# EAGLE design arduino nano (EAGLE 9.6.2)
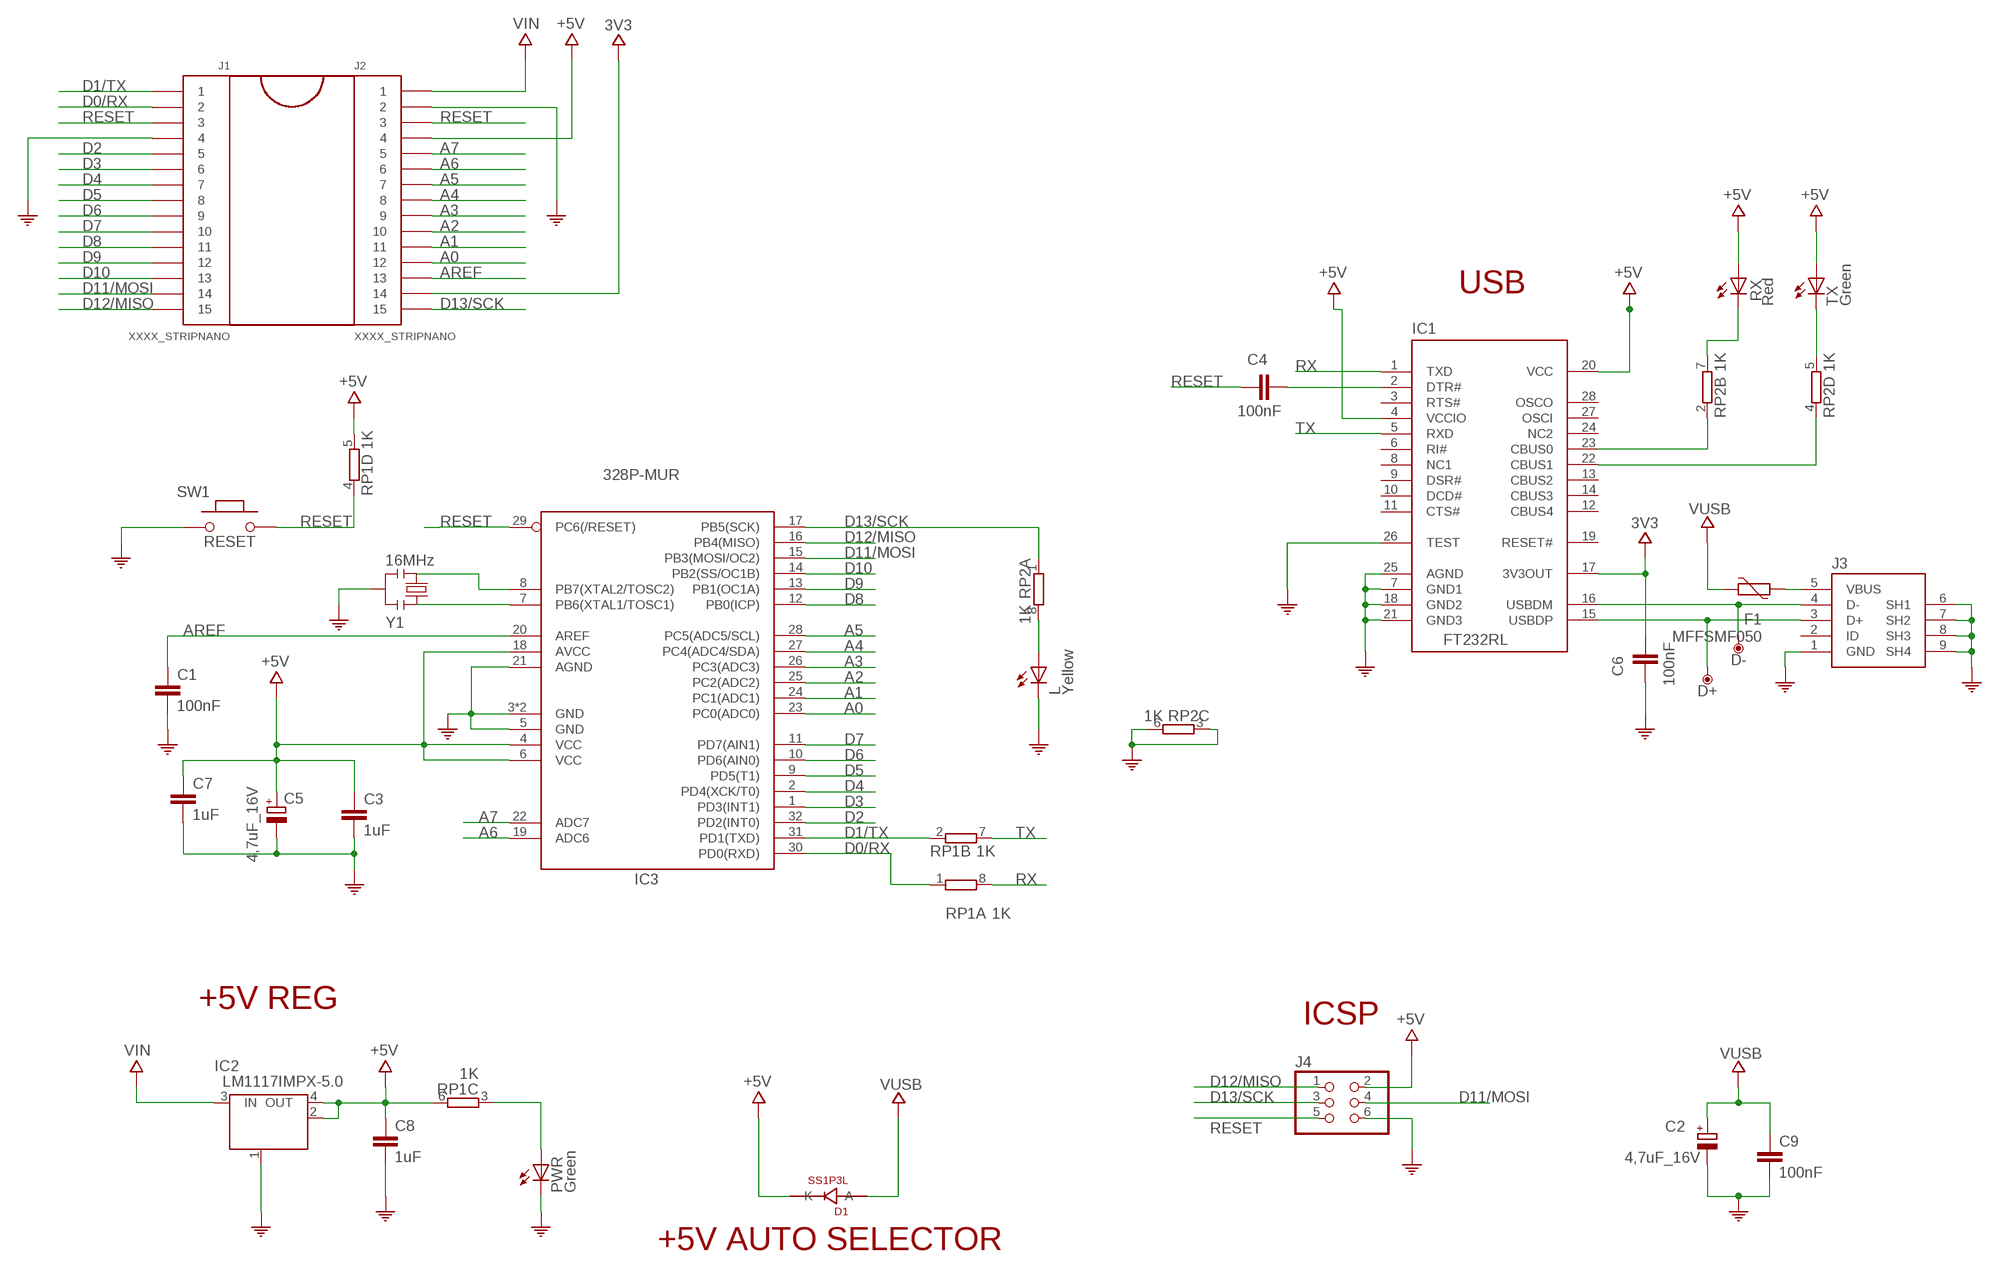
[diagram p0: schematic, sheet 1]

## Parts
C1  100nF  0015_100NF_0603  [C0603-ROUND]
C2  4,7uF_16V  0833_TAJA475MO16RNJ  [TAN-A]
C3  1uF  0006_1UF_0603/GRM188R61E105KA12D  [C0603-ROUND]
C4  100nF  0015_100NF_0603  [C0603-ROUND]
C5  4,7uF_16V  0833_TAJA475MO16RNJ  [TAN-A]
C6  100nF  0015_100NF_0603  [C0603-ROUND]
C7  1uF  0006_1UF_0603/GRM188R61E105KA12D  [C0603-ROUND]
C8  1uF  0006_1UF_0603/GRM188R61E105KA12D  [C0603-ROUND]
C9  100nF  0015_100NF_0603  [C0603-ROUND]
D1  SS1P3L  0025_SS1P3L-M3/84A  [DO220AAL]
D+  DNP  TPTP-1.00MM  [TP-1.00MM]
D-  DNP  TPTP-1.00MM  [TP-1.00MM]
F1  MFFSMF050  PTC  [0603-1608X90N]
IC1  FT232RL  0226_FT232RL  [SSOP28]
IC2  LM1117IMPX-5.0  0022_LM1117IMPX-5.0  [LINEAR_SOT223]
IC3  328P-MUR  ATMEGA328P-32MUR  [VQFN32]
J1  XXXX_STRIPNANO  [HEAD15-NOSS]
J2  XXXX_STRIPNANO  [HEAD15-NOSS]
J3  0219_14850  [USB-MINI-B_2]
J4  0114_PH254-203DF118A00V  [2X03]
L  Yellow  0044_KPT-2012YC  [CHIPLED_0805]
PWR  Green  0043_KPT-2012SGC  [CHIPLED_0805]
RP1  1K  0005_064R_1K_/_CAY16-102J4LF  [CAY16]
RP2  1K  0005_064R_1K_/_CAY16-102J4LF  [CAY16]
RX  Red  0181_KTP-2012SURCK  [CHIPLED_0805]
SW1  RESET  0173_IT-1185AP1C-160G-G_T&R  [SMD_157SW]
TX  Green  0043_KPT-2012SGC  [CHIPLED_0805]
Y1  16MHz  0011_CSTCE16M0V53-R0  [RESONATOR]

## Nets
3V3: C6.2 IC1.17(3V3OUT) J2.14
+5V: C3.1 C5.1(+) C7.1 C8.1 D1.P$1(K) IC1.4(VCCIO) IC1.20(VCC) IC2.2(OUT) IC2.4(OUT) IC3.4(VCC) IC3.6(VCC) IC3.18(AVCC) J2.4 J4.2 RP1.5 RP1.6 RX.A TX.A
A0: IC3.23(PC0(ADC0)) J2.12
A1: IC3.24(PC1(ADC1)) J2.11
A2: IC3.25(PC2(ADC2)) J2.10
A3: IC3.26(PC3(ADC3)) J2.9
A4: IC3.27(PC4(ADC4/SDA)) J2.8
A5: IC3.28(PC5(ADC5/SCL)) J2.7
A6: IC3.19(ADC6) J2.6
A7: IC3.22(ADC7) J2.5
AREF: C1.1 IC3.20(AREF) J2.13
COM: C1.2 C2.2(-) C3.2 C5.2(-) C6.1 C7.2 C8.2 C9.2 IC1.7(GND1) IC1.18(GND2) IC1.21(GND3) IC1.25(AGND) IC1.26(TEST) IC2.1(GND/ADJ) IC3.3(GND) IC3.5(GND) IC3.21(AGND) IC3.33(GND) J1.4 J2.2 J3.1(GND) J3.6(SH1) J3.7(SH2) J3.8(SH3) J3.9(SH4) J4.6 L.C PWR.C RP2.3 RP2.6 SW1.1 Y1.2
D0/RX: IC3.30(PD0(RXD)) J1.2 RP1.1
D1/TX: IC3.31(PD1(TXD)) J1.1 RP1.2
D2: IC3.32(PD2(INT0)) J1.5
D3: IC3.1(PD3(INT1)) J1.6
D4: IC3.2(PD4(XCK/T0)) J1.7
D5: IC3.9(PD5(T1)) J1.8
D6: IC3.10(PD6(AIN0)) J1.9
D7: IC3.11(PD7(AIN1)) J1.10
D8: IC3.12(PB0(ICP)) J1.11
D9: IC3.13(PB1(OC1A)) J1.12
D10: IC3.14(PB2(SS/OC1B)) J1.13
D11/MOSI: IC3.15(PB3(MOSI/OC2)) J1.14 J4.4
D12/MISO: IC3.16(PB4(MISO)) J1.15 J4.1
D13/SCK: IC3.17(PB5(SCK)) J2.15 J4.3 RP2.1
N$2: IC1.23(CBUS0) RP2.2
N$3: L.A RP2.8
N$4: D+.X IC1.15(USBDP) J3.3(D+)
N$7: C4.2 IC1.2(DTR#)
N$8: IC3.7(PB6(XTAL1/TOSC1)) Y1.1
N$9: IC3.8(PB7(XTAL2/TOSC2)) Y1.3
N$10: PWR.A RP1.3
N$13: F1.2 J3.5(VBUS)
N$14: D-.X IC1.16(USBDM) J3.4(D-)
N$15: IC1.22(CBUS1) RP2.4
N$16: RP2.5 TX.C
RESET: C4.1 IC3.29(PC6(/RESET)) J1.3 J2.3 J4.5 RP1.4 SW1.2
RX: IC1.1(TXD) RP1.8 RP2.7 RX.C
TX: IC1.5(RXD) RP1.7
VIN: IC2.3(IN) J2.1
VUSB: C2.1(+) C9.1 D1.P$2(A) F1.1
Unconnected: IC1.3(RTS#) IC1.6(RI#) IC1.8(NC1) IC1.9(DSR#) IC1.10(DCD#) IC1.11(CTS#) IC1.12(CBUS4) IC1.13(CBUS2) IC1.14(CBUS3) IC1.19(RESET#) IC1.24(NC2) IC1.27(OSCI) IC1.28(OSCO) J3.2(ID)

## Notes on the sheet
- USB
- +5V REG
- ICSP
- +5V AUTO SELECTOR

## Library data of the parts
C1 C4 C6 C9 = Condensatori:0015_100NF_0603: 100nF 0603 50V; CASE: 0603; MONTHLY_USAGE: _____; PART_NUMBER: cl10b104kbnc; PRICE: _____; SUPPLIER: _____; TYPE: Condensatori
C2 C5 = Condensatori:0833_TAJA475MO16RNJ: 4,7uF; CASE: Case_A_(1206); MONTHLY_USAGE: _____; PART_NUMBER: TAJA475MO16RNJ; PRICE: _____; SUPPLIER: _____; TYPE: Condensatori
C3 C7 C8 = Condensatori:0006_1UF_0603/GRM188R61E105KA12D: 1uF 0603; CASE: 0603; MONTHLY_USAGE: _____; PART_NUMBER: 1uF_0603/GRM188R61E105KA12D; PRICE: _____; SUPPLIER: _____; TYPE: Condensatori
D1 = Diodi:0025_SS1P3L-M3/84A: 1A 30V Schottky Barrier Rectifiers -SS1P3L-M3/84A; CASE: SMP; MONTHLY_USAGE: _____; PART_NUMBER: SS1P3L-M3/84A; PRICE: _____; SUPPLIER: _____; TYPE: Diodi
D+ D- = Arduino-utility:TP: Testpoint; DATASHEET: DNP; DISTRIBUTOR-LINK: DNP; DISTRIBUTOR-PN: DNP; MANUFACTURER: DNP; MANUFACTURER-PN: DNP
F1 = Arduino-rcl:PTC: SMD PTC; DATASHEET: http://www.bourns.com/docs/Product-Datasheets/mffsmf.pdf; DISTRIBUTOR-LINK: http://www.digikey.com/product-detail/en/bourns-inc/MF-FSMF050X-2/MF-FSMF050X-2CT-ND/2039389; DISTRIBUTOR-PN: MF-FSMF050X-2CT-ND; MANUFACTURER: Bourns Inc; MANUFACTURER-PN: MF-FSMF050X-2
IC1 = IntegratedCircuits:0226_FT232RL: USB to serial UART interface -FT232RL; CASE: SSOP28; MONTHLY_USAGE: _____; PART_NUMBER: FT232RL; PRICE: _____; SUPPLIER: _____; TYPE: Circuito_Integrato
IC2 = IntegratedCircuits:0022_LM1117IMPX-5.0: Low-dropout linear regulator 5V -LM1117IMPX-5.0; CASE: SOT223; MONTHLY_USAGE: _____; PART_NUMBER: LM1117IMPX-5.0; PRICE: _____; SUPPLIER: _____; TYPE: Circuito_Integrato
IC3 = Arduino-ucs&SoCs:ATMEGA328P-32: 8-bit Microcontroller with 32KBytes In-System Programmable Flash ATMEGA328P-AU; DATASHEET: http://www.atmel.com/images/Atmel-8271-8-bit-AVR-Microcontroller-ATmega48A-48PA-88A-88PA-168A-168PA-328-328P_datasheet_Complete.pdf; DISTRIBUTOR-LINK: https://www.digikey.it/product-detail/it/microchip-technology/ATMEGA328P-MUR/ATMEGA328P-MURCT-ND/3440953; DISTRIBUTOR-PN: ATMEGA328P-MURCT-ND; MANUFACTURER: ATMEL; MANUFACTURER-PN: ATMEGA328P-MUR
J1 J2 = Connettori:XXXX_STRIPNANO: Strip passo 2,54 a 15 pin per Arduino Nano; VALUE: Strip15pin
J3 = Connettori:0219_14850: Usb-Mini F 90 Smd; MONTHLY_USAGE: _____; PART_NUMBER: 14850; PRICE: _____; SUPPLIER: _____; TYPE: Connettori; VALUE: USB-mini-90 -SMD
J4 = Connettori:0114_PH254-203DF118A00V: 3x2 M V h 8,5 mm p2,54; MONTHLY_USAGE: _____; PART_NUMBER: PH254-203DF118A00V; PRICE: _____; SUPPLIER: _____; TYPE: Connettori; VALUE: ICSP
L = Opto:0044_KPT-2012YC: LED YELLOW - SMD - 0805; MONTHLY_USAGE: _____; PART_NUMBER: KPT-2012YC; PRICE: _____; SUPPLIER: _____; TYPE: Opto
PWR TX = Opto:0043_KPT-2012SGC: LED GREEN - SMD-0805; MONTHLY_USAGE: _____; PART_NUMBER: KPT-2012SGC; PRICE: _____; SUPPLIER: _____; TYPE: Opto
RP1 RP2 = Resistenze:0005_064R_1K_/_CAY16-102J4LF: 1K 064R; CASE: SMD_3,2x1,6; MONTHLY_USAGE: _____; PART_NUMBER: 064R_1K_/_CAY16-102J4LF; PRICE: _____; SUPPLIER: _____; TYPE: Resistenze
RX = Opto:0181_KTP-2012SURCK: LED RED - SMD - 0805; MONTHLY_USAGE: _____; PART_NUMBER: KTP-2012SURCK; PRICE: _____; SUPPLIER: _____; TYPE: Opto
SW1 = Switches:0173_IT-1185AP1C-160G-G_T&R: Pushbutton 4x3 SMD H2,5mm; MONTHLY_USAGE: _____; PART_NUMBER: IT-1185AP1C-160G-G_T&R; PRICE: _____; SUPPLIER: _____; TYPE: Switches; VALUE: 157SW
Y1 = Cristalli:0011_CSTCE16M0V53-R0: 16Mhz - SMD; MONTHLY_USAGE: _____; PART_NUMBER: CSTCE16M0V53-R0; PRICE: _____; SUPPLIER: _____; TYPE: Cristalli; VALUE: CSTCE16M0V53-R0

## Board
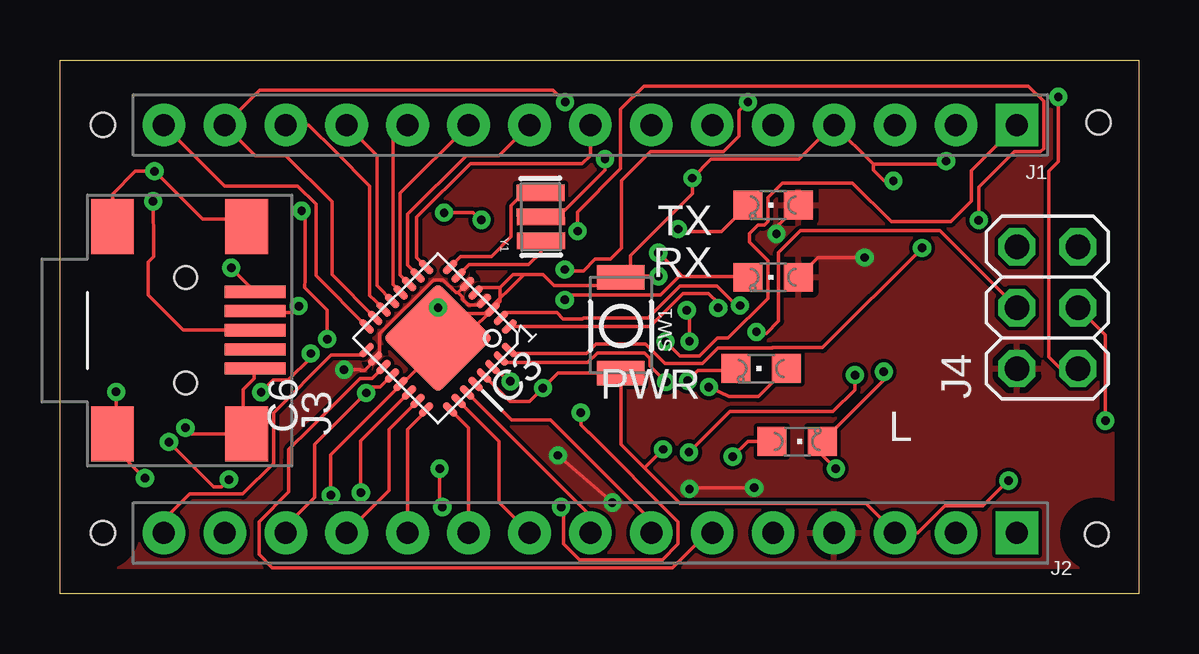
[diagram p1: board, top side]
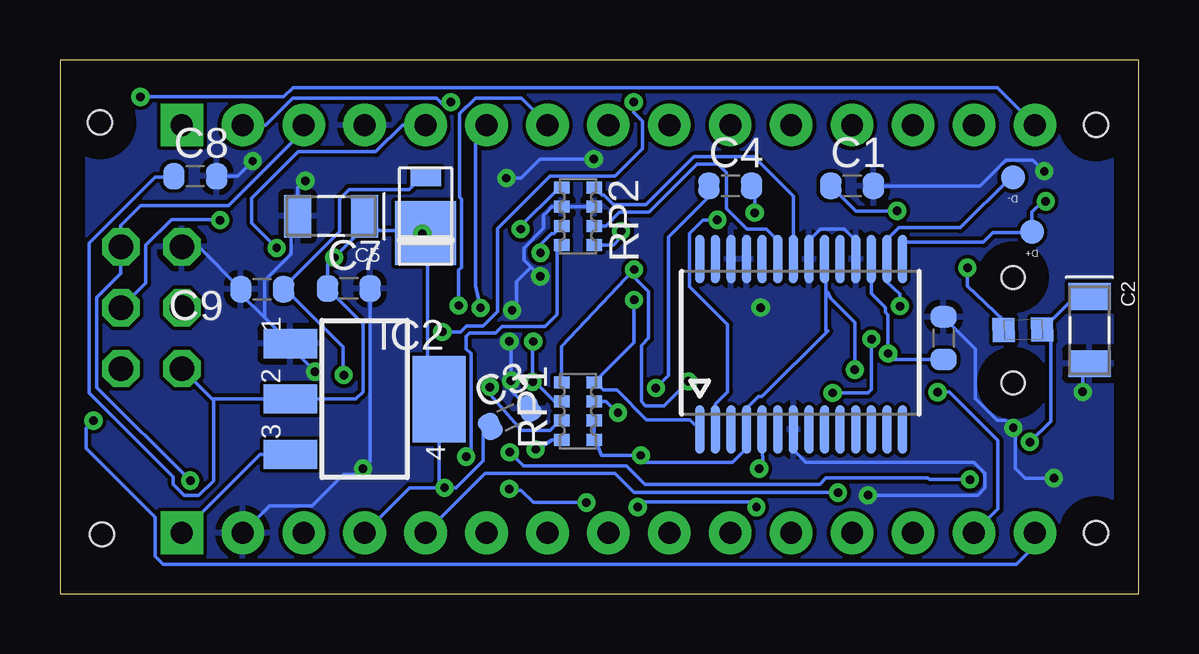
[diagram p2: board, bottom side, seen from below]

Size 44.97 x 22.26 mm. Coordinates in mm from the lower left corner, seen from the top.
Outline: 44.97,0 0,0 0,22.26 44.97,22.26 44.97,0
Copper layers (1*16): Top 0.035mm / dielectric 1.5mm / Bottom 0.035mm
Design rules "default": minimum track width 6mil, minimum drill 0.35mm, track to track 6mil, track to pad 6mil, pad to pad 6mil, via to via 6mil, smd to smd 6mil, copper to edge 40mil, drill to drill 6mil, minimum pad ring 10mil, minimum via ring 8mil, stop-mask expansion 4mil, vias tented up to drill 0mil, thermal gap 10mil
Holes 1 mm at 1.79,2.54 1.79,19.55 43.22,2.48 43.3,19.65

### Footprints (pad centres in the part's own frame; a part is rotated, then mirrored left to right if it is on the bottom)
C0603-ROUND = smd 0.898 x 1.1: 1 -0.889,0; 2 0.889,0
TAN-A = smd 1.118 x 1.778: 1 0,0; 2 2.794,0
DO220AAL = smd 2.667 x 2.54: P$1 -0.7,0 | smd 0.762 x 1.27: P$2 1.65,0
TP-1.00MM = smd 1 x 1 bottom: X 0,0
0603-1608X90N = smd 0.95 x 1: 1 -0.8,0; 2 0.8,0
SSOP28 = smd 0.381 x 2.032: 1 0,0; 2 0.65,0; 3 1.3,0; 4 1.95,0; 5 2.6,0; 6 3.25,0; 7 3.9,0; 8 4.55,0; 9 5.2,0; 10 5.85,0; 11 6.5,0; 12 7.15,0; 13 7.8,0; 14 8.45,0; 15 8.45,7.112; 16 7.8,7.112; 17 7.15,7.112; 18 6.5,7.112; 19 5.85,7.112; 20 5.2,7.112; 21 4.55,7.112; 22 3.9,7.112; 23 3.25,7.112; 24 2.6,7.112; 25 1.95,7.112; 26 1.3,7.112; 27 0.65,7.112; 28 0,7.112
LINEAR_SOT223 = smd 1.219 x 2.235: 1 -2.311,-3.099; 2 0,-3.099; 3 2.311,-3.099 | smd 3.6 x 2.2: 4 0,3.099
VQFN32 = smd 0.7 x 0.28: 1 -2.45,1.75; 2 -2.45,1.25; 3 -2.45,0.75; 4 -2.45,0.25; 5 -2.45,-0.25; 6 -2.45,-0.75; 7 -2.45,-1.25; 8 -2.45,-1.75; 17 2.45,-1.75; 18 2.45,-1.25; 19 2.45,-0.75; 20 2.45,-0.25; 21 2.45,0.25; 22 2.45,0.75; 23 2.45,1.25; 24 2.45,1.75 | smd 0.28 x 0.7: 9 -1.75,-2.45; 10 -1.25,-2.45; 11 -0.75,-2.45; 12 -0.25,-2.45; 13 0.25,-2.45; 14 0.75,-2.45; 15 1.25,-2.45; 16 1.75,-2.45; 25 1.75,2.45; 26 1.25,2.45; 27 0.75,2.45; 28 0.25,2.45; 29 -0.25,2.45; 30 -0.75,2.45; 31 -1.25,2.45; 32 -1.75,2.45 | smd 3.254 x 3.254: 33 0,0
HEAD15-NOSS = drill 0.914 pad 1.778 square: 1 0,0 | drill 0.914 pad 1.778: 2 2.54,0; 3 5.08,0; 4 7.62,0; 5 10.16,0; 6 12.7,0; 7 15.24,0; 8 17.78,0; 9 20.32,0; 10 22.86,0; 11 25.4,0; 12 27.94,0; 13 30.48,0; 14 33.02,0; 15 35.56,0
USB-MINI-B_2 = smd 0.508 x 2.54: 1 0,0; 2 0.8,0; 3 1.6,0; 4 2.4,0; 5 3.2,0 | smd 2.286 x 1.778: 6 -2.717,5.948; 7 -2.717,0.36; 8 5.918,0.36; 9 5.918,5.948 | hole 0.95: -0.6,2.9; 3.8,2.9
2X03 = drill 1.016 pad 1.55 octagon: 1 -2.54,-1.27; 2 -2.54,1.27; 3 0,-1.27; 4 0,1.27; 5 2.54,-1.27; 6 2.54,1.27
CHIPLED_0805 = smd 1.2 x 1.2: A 0,-1.05; C 0,1.05
CAY16 = smd 0.5 x 0.65: 1 -1.2,-0.675; 2 -0.4,-0.675; 3 0.4,-0.675; 4 1.2,-0.675; 5 1.2,0.675; 6 0.4,0.675; 7 -0.4,0.675; 8 -1.2,0.675
SMD_157SW = smd 1.016 x 1.981: 1 0,0; 2 4,0
RESONATOR = smd 0.7 x 2: 1 -1,0; 2 0,0; 3 1,0

### Placement (x,y rotation side)
C1  11.95,17.01 0 bottom
C2  2.06,12.39 270 bottom
C3  26.22,7.35 24.7 bottom
C4  17.03,17.01 0 bottom
C5  32.27,15.74 180 bottom
C6  8.14,10.66 270 bottom
C7  32.93,12.73 0 bottom
C8  39.33,17.41 0 bottom
C9  36.54,12.7 180 bottom
D1  29.73,15.74 90 bottom
D+  4.45,15.09 180 top
D-  5.25,17.36 180 top
F1  4.83,11.01 181.2 bottom
IC1  18.3,6.85 0 bottom
IC2  32.27,8.12 270 bottom
IC3  15.76,10.66 225 top
J1  39.89,19.55 180 top
J2  39.89,2.54 180 top
J3  8.14,9.39 90 top
J4  41.16,11.93 90 top
L  30.73,6.35 270 top
PWR  29.23,9.39 90 top
RP1  23.38,7.62 270 bottom
RP2  23.38,15.74 90 bottom
RX  29.73,13.2 90 top
SW1  23.38,13.2 270 top
TX  29.73,16.21 90 top
Y1  20.04,15.72 90.7 top

### Tracks (layer width: path | path; a pad name or v marks a point on that pad's centre or on a via)
3V3  (via drill 0.35)
  Top 0.152: v8.39,8.41 8.89,8.91 9.5,8.91 10.44,9.84 v10.45,10.02
  Bottom 0.152: J2.14 5.87,3.54 5.87,6.39 7.89,8.41 v8.39,8.41 | C6.2 10.2,9.77 v10.45,10.02 10.45,11.63 10.56,11.75 10.56,11.94 11.15,12.53 IC1.17
+5V  (via drill 0.35)
  Top 0.152: RX.A 31.6,14.02 v33.54,14.02 | v23.02,3.8 v20.76,5.77 | v11.84,9.35 12.51,9.35 12.54,9.32 12.69,9.32 13.12,9.75 IC3.18 13.33,10 13.33,10.86 15.56,13.09 15.98,13.09 16.5,12.56 16.6,12.56 | IC3.6 16.6,12.56 | IC3.4 17.49,12.04 17.03,12.04 17,12.06 | v26.24,4.37 26.29,4.42 v28.94,4.42 | 16.6,12.56 16.79,12.38 16.79,12.28 17,12.06 | 16.98,12.06 17,12.06 | TX.A 29.86,15.29 v29.86,15.01
  Bottom 0.152: 38.57,8.12 IC2.2 32.64,8.12 32.34,8.42 32.34,11.25 C7.1 33.82,13.74 v33.54,14.02 32.15,15.41 32.15,15.62 C5.1 31.67,15.14 30.21,15.14 29.72,14.86 | 38.57,8.12 38.62,8.12 J4.2 | IC2.4 29.17,8.02 | 29.17,8.02 29.17,4.65 v28.94,4.42 | 29.17,8.02 29.64,8.49 29.64,14.95 D1.P$1 | D1.P$1 | RP1.6 22.72,7.16 22.72,6.55 RP1.5 22.65,6.41 22.41,5.77 20.82,5.77 v20.76,5.77 20.59,5.54 20.55,5.48 16.93,5.48 16.35,6.06 IC1.4 16.32,7.76 15.86,8.22 15.71,8.22 12.97,10.97 13.04,10.97 13.04,12.63 | C3.1 27.33,6.67 27.33,5.54 28.45,4.42 v28.94,4.42 | v23.02,3.8 25.24,3.8 25.76,4.32 26.24,4.32 v26.24,4.37 | 13.04,12.63 13.04,13.9 IC1.20 | 38.57,8.12 38.57,4.72 39.18,4.11 39.79,4.11 40.25,4.56 40.25,4.87 43.75,8.37 43.75,14.62 41.01,17.37 40.25,17.37 C8.1 | 13.04,12.63 12.99,12.58 12.84,12.32 11.84,11.32 v11.84,9.35 | v28.94,4.42 30.39,4.42 J2.4 | 29.62,14.8 29.72,14.86 | 30.01,15.03 D1.P$1 | v29.86,15.01 29.86,15 29.72,14.86
  pour Top: -1.86,23.12 -1.86,-1.28 46.14,-1.28 46.14,23.12
A0
  Top 0.152: IC3.23 13.72,6.85 13.72,4.31 J2.12
A1
  Top 0.152: IC3.24 15.27,7.62 14.49,6.85 J2.11
A2
  Top 0.152: IC3.25 17.03,6.91 J2.10
A3
  Top 0.152: J2.9 18.3,3.81 18.3,6.35 IC3.26
A4
  Top 0.152: J2.8 22.11,3.25 IC3.27
A5
  Top 0.152: J2.7 24.65,3.04 20.44,7.25 18.82,7.25 IC3.28
A6
  Top 0.152: J2.6 26.99,2.54 25.54,1.09 8.84,1.09 8.29,1.64 8.29,1.82 8.29,3 9.54,4.25 9.54,5.62 9.54,6.02 10.44,6.92 10.45,6.92 12.51,8.98 13.02,8.98 IC3.19
A7  (via drill 0.35)
  Top 0.152: IC3.22 12.54,6.38 v12.54,4.22
  Bottom 0.152: J2.5 27.25,5.02 21.84,5.02 21.04,4.22 v12.54,4.22
AREF  (via drill 0.35)
  Top 0.152: J2.13 9.41,2.82 10.62,4.03 10.62,6.23 v12.76,8.37 13.01,8.62 13.34,8.62 13.82,9.1 IC3.20 | v11.14,10.62 11.14,11.83 10.2,12.77 10.22,13.1 10.22,15.84 v10.07,15.97
  Bottom 0.152: C1.1 11.8,15.97 v10.07,15.97 | v11.14,10.62 11.14,8.52 11.29,8.37 v12.76,8.37
COM  (via drill 0.35)
  Top 0.152: 16.68,11.93 v15.76,11.93 | J3.7 7.78,6.72 | L.C 31.93,6.35 | 2.29,7.47 2.19,7.37 2.19,7.22 2.29,7.32 | 20.04,15.82 Y1.2 20.13,15.84 20.89,15.84 22.72,17.67 v22.72,18.13 | 2.34,7.37 2.29,7.32 | J3.9 2.19,16.67 3.14,17.62 v3.94,17.62 5.94,15.62 7.47,15.62 J3.8 | J3.7 5.48,6.67 v5.23,6.92 | v32.34,5.22 31.78,5.78 L.C | L.C 34.34,8.91 v34.34,9.26 | 15.71,10.92 15.71,11.88 v15.76,11.93 | 15.71,10.92 15.71,10.66 | 15.71,10.66 15.71,10.2 | 15.71,10.66 IC3.33 | J3.1 8.09,9.29 8.09,8.98 7.63,8.53 7.63,6.7 J3.7 | SW1.1 23.78,13.4 23.78,14.11 26.36,16.69 v26.36,17.33 27.14,18.13 30.8,18.13 32.17,19.5 J1.4 33.9,17.92 | 15.71,10.2 14.34,8.83 IC3.21 14.18,8.68 11.29,5.78 v11.29,4.11 | 15.71,10.2 IC3.33 | 17.03,11.66 16.76,11.66 IC3.33 | 2.29,7.32 2.3,7.31 2.3,6.7 J3.6 | SW1.1 23.04,12.86 20.6,12.86 20.14,13.32 19.34,13.32 | 18.34,12.77 17.52,12.77 IC3.5 | SW1.1 23.42,13.24 v24.95,13.24 | v3.54,4.82 2.19,6.17 J3.6 | v2.34,8.42 2.34,6.82 J3.6 | 18.34,12.77 18.34,12.18 IC3.3 17.08,10.92 15.71,10.92 | PWR.C 28.15,9.42 28.04,9.31 26.6,9.31 v26.17,8.89 | IC3.5 17.23,12.49 IC3.5 | 33.9,17.92 36.94,17.92 v36.94,18.04 | 33.9,17.92 33.9,17.66 34.34,17.22 v34.74,17.22 | v26.13,11.82 26.24,11.71 v26.24,10.53 | 18.34,12.77 18.89,13.32 19.34,13.32 | v15.76,11.93 16.68,11.93 16.93,11.69 17.71,11.69 19.34,13.32
  Bottom 0.152: 13.75,14.73 IC1.21 13.72,13.99 13.72,14.76 13.27,15.21 12.28,15.21 11.83,14.76 11.83,13.99 IC1.18 | 24.12,16.12 24.1,16.14 RP2.3 | IC2.1 35.45,10.51 | 35.45,10.51 36.45,11.51 | 36.45,11.51 37.43,12.49 C9.2 39.2,14.47 J4.6 | C1.2 6.63,17.01 5.55,18.09 4.41,18.09 v3.94,17.62 | C6.1 6.81,10.22 6.81,8.14 5.89,7.22 5.53,7.22 v5.23,6.92 5.15,6.84 5.15,6.08 5.14,6.07 5.14,5.22 4.74,4.82 v3.54,4.82 | J2.2 36.23,3.66 34.45,3.66 33.14,4.97 32.59,4.97 v32.34,5.22 32.03,5.53 32.03,11.38 32.04,11.38 C7.2 | v34.34,9.26 35.45,10.37 35.45,10.51 | 35.26,15.54 35.33,15.47 35.33,14.17 36.45,13.05 36.45,11.51 | v22.72,18.13 24.96,18.13 25.76,17.33 v26.36,17.33 | v11.29,4.11 6.72,4.11 6.41,4.41 6.41,5.02 6.87,5.48 13.88,5.48 14.34,5.94 14.34,6.85 IC1.7 | C2.2 2.34,9.32 v2.34,8.42 | 35.1,15.54 35.26,15.54 | 24.15,16.14 RP2.6 24.45,16.14 24.68,15.92 24.67,15.92 24.8,15.79 24.8,15.25 25.63,14.42 25.63,13.93 25.33,13.63 | C3.2 26.17,8.48 v26.17,8.89 26.17,10.46 v26.24,10.53 | v36.94,18.04 37.57,17.41 C8.2 | 35.26,15.54 C5.2 35.06,16.94 34.94,17.06 34.85,17.11 v34.74,17.22 | v24.95,13.24 25.33,13.63 | 25.33,13.63 25.94,13.02 25.94,12.12 | 25.94,12.12 25.94,12.02 | 25.94,12.12 26.13,11.93 v26.13,11.82
  pour Bottom: -2.86,24.02 -2.86,-2.38 46.34,-2.38 46.74,-1.98 46.74,23.62 46.34,24.02
D0/RX  (via drill 0.35)
  Top 0.152: v28.68,20.5 28.31,20.14 28.31,19.09 27.65,18.43 24.62,18.43 23.41,17.22 23.41,14.42 22.94,13.95 22.31,13.95 21.81,13.46 21.1,13.46 v21.04,13.52 | IC3.30 18.1,9.46 18.74,8.82 v18.78,8.86
  Bottom 0.152: J1.2 36.39,19.55 35.27,20.67 29.27,20.67 28.93,20.33 28.85,20.33 v28.68,20.5 | v18.78,8.86 19.8,7.84 20.56,7.84 20.74,8.02 20.74,10.35 20.43,10.66 20.43,12.6 20.99,13.16 v21.04,13.52 24.05,10.3 RP1.1
D1/TX  (via drill 0.35)
  Top 0.152: IC3.31 18.55,9.64 21.99,9.64 22.4,10.04 24.36,10.04 24.6,9.8 24.6,9.5 v25.27,8.83 | J1.1 37.99,17.65 37.99,16.37 37.14,15.52 34.65,15.52 33.04,17.13 30.12,17.13 29.51,16.52 29.51,15.52 29.38,15.38 29.1,15.38 28.74,15.02 28.74,14.66 29.51,13.89 29.51,12.32 27.85,10.66 27.41,10.66 26.66,9.92 25.84,9.92 v25.24,10.52
  Bottom 0.152: v25.24,10.52 25.28,10.48 25.27,10.44 v25.27,8.83 25.17,8.83 24.38,8.04 24.08,8.04 RP1.2
D2  (via drill 0.35)
  Top 0.152: IC3.32 18.88,10.02 21.94,10.02 22.34,10.42 24.41,10.42 25.22,9.61 26.79,9.61 27.43,10.25 29.69,10.25 29.7,10.26 31.78,10.26 v35.94,14.42
  Bottom 0.152: v35.94,14.42 36.98,15.46 36.98,16.5 35.04,18.43 31.81,18.43 30.69,19.55 J1.5
D3  (via drill 0.35)
  Top 0.152: IC3.1 24.6,11.16 25.97,12.52 27.04,12.52 27.44,12.12 v27.44,11.92
  Bottom 0.152: v27.44,11.92 27.65,12.83 27.65,19.09 J1.6
D4  (via drill 0.35)
  Top 0.152: IC3.2 18.59,11.72 20.72,11.72 20.98,11.46 21.78,11.46 21.82,11.5 24.52,11.5 25.84,12.83 27.39,12.83 28.05,12.17 28.05,12.12 28.15,12.02 v28.35,12.02
  Bottom 0.152: J1.7 24.65,19.59 25.73,20.67 27.65,20.67 28.31,20.01 28.31,16.54 28.23,16.47 28.23,13.61 28.35,13.49 v28.35,12.02
D5
  Top 0.152: J1.8 22.11,18.28 21.77,17.94 17.11,17.94 14.86,15.7 14.86,14.03 IC3.9
D6
  Top 0.152: IC3.10 14.49,13.7 14.49,15.83 16.94,18.28 18.3,18.28 J1.9
D7
  Top 0.152: IC3.11 14.18,13.3 14.18,16.7 J1.10
D8
  Top 0.152: J1.11 13.88,18.94 13.88,12.89 IC3.12
D9
  Top 0.152: IC3.13 13.22,12.85 13.22,18.28 J1.12
D10
  Top 0.152: IC3.14 13.14,12.22 12.91,12.44 12.91,17.01 11.49,18.43 10.37,19.55 J1.13
D11/MOSI  (via drill 0.35)
  Top 0.152: IC3.15 11.34,13.31 11.34,16.35 9.41,18.28 8.14,18.28 J1.14 8.32,21 20.56,21 v21.06,20.5 | J4.4 36.68,15.14 30.87,15.14 29.95,14.22 29.95,11.37 29.44,10.86 29.09,10.86 v29.03,10.92
  Bottom 0.152: v21.06,20.5 21.06,20.08 20.69,19.71 20.69,18.57 21.84,17.42 24.54,17.42 26.73,15.23 26.73,11.77 27.33,11.17 28.02,11.17 28.27,10.92 v29.03,10.92
D12/MISO  (via drill 0.35)
  Top 0.152: IC3.16 10.68,13.27 10.68,16.24 9.91,17.01 6.87,17.01 J1.15 | J4.1 41.7,9.39 41.21,9.87 41.21,17.62 41.61,18.02 v41.61,20.72
  Bottom 0.152: v41.61,20.72 35.65,20.72 35.26,21.11 5.89,21.11 J1.15
D13/SCK  (via drill 0.35)
  Top 0.152: J2.15 4.33,3.08 5.41,4.16 7.62,4.16 8.9,5.44 8.9,7.54 11.31,9.95 12.58,9.95 IC3.17 | v43.58,7.22 43.58,10.78 J4.3 | v38.3,15.58 38.3,16.95 39.78,18.43 40.87,18.43 41.01,18.57 41.01,20.53 40.37,21.17 24.34,21.17 23.37,20.2 23.37,17.72 21.58,15.92 v21.58,15.12
  Bottom 0.152: J4.3 41.39,12.97 41.39,14.53 40.32,15.61 38.35,15.61 v38.3,15.58 | J2.15 4.33,2 5.11,1.22 40.67,1.22 41.01,1.56 41.01,3.19 43.88,6.06 43.88,6.92 v43.58,7.22 | RP2.1 21.91,14.54 21.58,14.87 v21.58,15.12
N$2
  Bottom 0.152: IC1.23 15.05,14.73 15.53,15.21 16.33,15.21 17.19,16.07 17.19,17.57 17.54,17.91 18.41,17.91 20.41,15.91 21.64,15.91 22.22,15.34 RP2.2
N$3  (via drill 0.35)
  Top 0.152: L.A 28.67,6.35 v28.04,5.72
  Bottom 0.152: v28.04,5.72 27.94,5.72 27.84,5.82 27.84,10.01 28.04,10.21 28.04,10.72 27.89,10.87 26.82,10.87 26.54,11.15 24.75,11.15 24.25,11.65 24.25,14.34 RP2.8
N$4  (via drill 0.35)
  Top 0.152: J3.3 5.14,10.99 3.67,12.46 3.67,13.84 3.9,14.06 3.9,14.48 v3.88,16.36
  Bottom 0.152: IC1.15 9.85,14.66 6.48,14.66 6.08,15.06 4.48,15.06 D+.X 4.45,15.91 4,16.36 v3.88,16.36
N$7  (via drill 0.35)
  Top 0.152: v17.57,15.59 17.53,15.59 17.23,15.89 v16.01,15.89
  Bottom 0.152: IC1.2 17.65,7.91 17.14,8.42 17.14,11.22 18.74,12.82 18.74,15.02 18.17,15.59 v17.57,15.59 | C4.2 16.01,16.88 v16.01,15.89
N$8
  Top 0.152: IC3.7 17.05,13.72 19.54,13.72 20.05,14.23 Y1.1
N$9
  Top 0.152: IC3.8 16.69,14.07 17.99,14.07 18.81,14.89 18.81,16.18 19.34,16.72 Y1.3
N$10  (via drill 0.35)
  Top 0.152: v27.05,8.62 27.88,8.22 29.11,8.22 PWR.A
  Bottom 0.152: RP1.3 24.15,7.22 24.55,6.82 25.72,6.82 27.05,8.31 v27.05,8.62
N$13  (via drill 0.35)
  Top 0.152: J3.5 v7.14,13.59
  Bottom 0.152: F1.2 5.63,11.39 7.14,12.84 v7.14,13.59
N$14  (via drill 0.35)
  Top 0.152: v9.95,12 9.68,11.72 8.21,11.72 J3.4
  Bottom 0.152: D-.X 5.34,17.36 7.44,15.26 10,15.26 10.54,14.72 10.54,14 IC1.16 10.5,12.99 9.95,12.5 v9.95,12
N$15
  Bottom 0.152: IC1.22 14.4,16.58 16.04,18.22 18.54,18.22 20.54,16.22 21.89,16.22 22.28,16.62 22.38,16.62 RP2.4
N$16  (via drill 0.35)
  Top 0.152: TX.C 27.56,15.09 25.88,15.09 v25.77,15.21
  Bottom 0.152: RP2.5 24.16,16.94 24.28,16.82 24.27,16.82 25.77,15.33 v25.77,15.21
RESET  (via drill 0.35)
  Top 0.152: v39.54,4.72 38.48,3.66 36.89,3.66 35.77,2.54 J2.3 33.59,3.77 25.84,3.77 24.36,5.24 | IC3.29 18.75,8.02 19.57,8.02 v20.13,8.58 20.75,9.2 SW1.2 23.38,6.22 24.36,5.24 | v25.14,6.02 24.36,5.24
  Bottom 0.152: C4.1 17.92,16.56 19.6,14.88 19.6,9.11 v20.13,8.58 | v39.54,4.72 43.43,8.61 43.43,12.35 42.43,13.35 J4.5 42.43,15.35 41.59,16.18 37.94,16.18 36.33,17.79 34.81,19.31 J1.3 | RP1.4 24.45,6.42 25.14,5.99 v25.14,6.02
RX  (via drill 0.35)
  Top 0.152: RX.C 28.56,13.2 28.55,13.21 28.55,13.22 28.36,13.22 25.94,13.22 | v21.04,12.26 21.24,12.45 25.04,12.45 25.81,13.22 25.94,13.22 | 25.94,13.22 v24.94,14.22
  Bottom 0.152: v21.04,12.26 21.04,10.48 22.67,8.85 | 22.67,8.85 RP1.8 | 22.67,8.85 22.32,8.5 21.76,8.5 20.51,7.25 18.7,7.25 IC1.1 | RP2.7 24.38,15.02 24.48,15.02 25.04,14.45 v24.94,14.22
TX  (via drill 0.35)
  Top 0.152: v20.89,3.61 20.99,3.51 20.99,2.08 21.65,1.42 25.11,1.42 25.77,2.08 25.77,3 22.05,6.72 22.04,6.72 21.71,7.05 v21.71,7.55 | v15.94,3.61 15.83,3.73 v15.83,5.22
  Bottom 0.152: IC1.5 15.67,5.38 v15.83,5.22 | v20.89,3.61 20.67,3.83 16.15,3.83 v15.94,3.61 | RP1.7 22.2,8.02 21.74,7.55 v21.71,7.55
VIN
  Bottom 0.152: IC2.3 36.62,5.81 J2.1
VUSB  (via drill 0.35)
  Top 0.152: v33.14,9.12 33.14,8.5 32.22,7.6 27.92,7.6 v26.22,5.9 | v7.04,4.76 6.74,4.46 6.4,4.46 v4.54,6.33
  Bottom 0.152: v26.22,5.9 25.65,5.33 21.35,5.33 20.59,4.57 13.29,4.57 13.03,4.83 8.79,4.83 8.73,4.76 v7.04,4.76 | C2.1 2.65,12.39 F1.1 3.74,11.01 3.67,10.94 3.67,7.19 v4.54,6.33 | D1.P$2 29.89,17.39 30.42,16.86 32.92,16.86 33.32,16.46 33.32,15.1 35.65,12.77 C9.1 35.59,12.7 33.17,10.29 33.17,9.15 v33.14,9.12